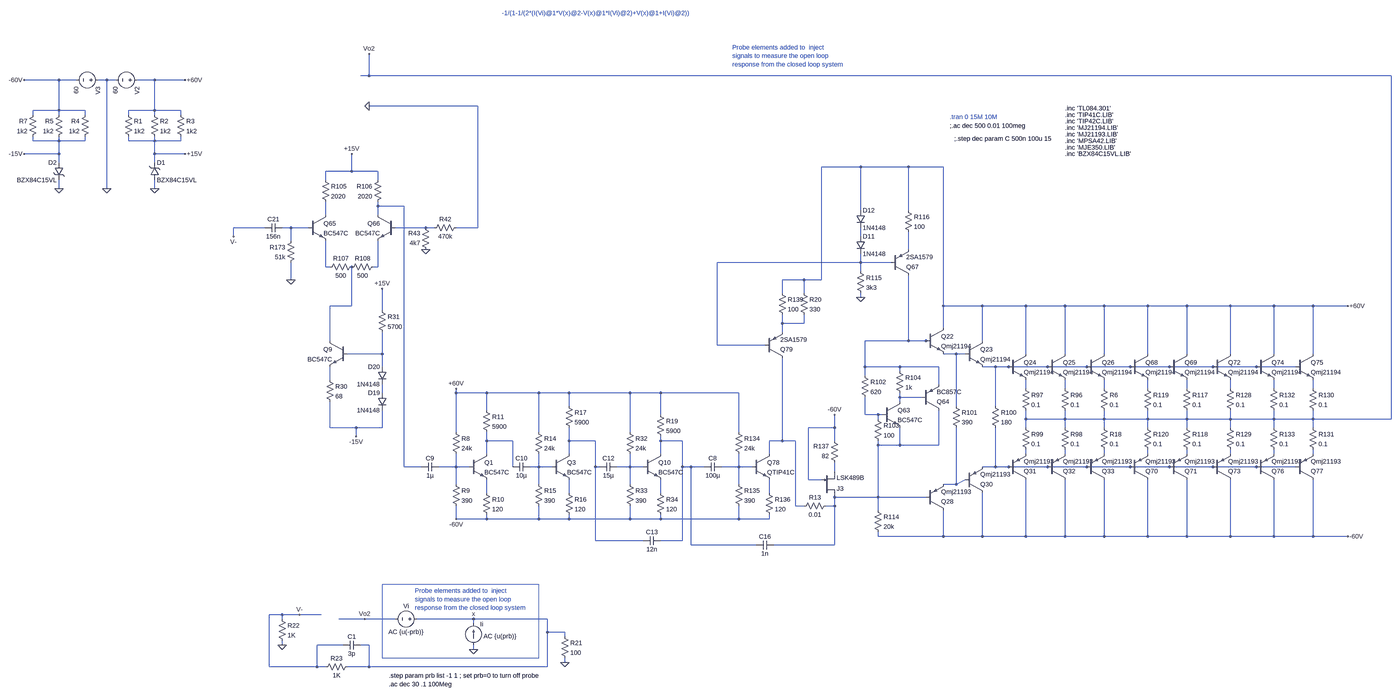
[diagram p0: schematic testV11_OL.asc, whole sheet]
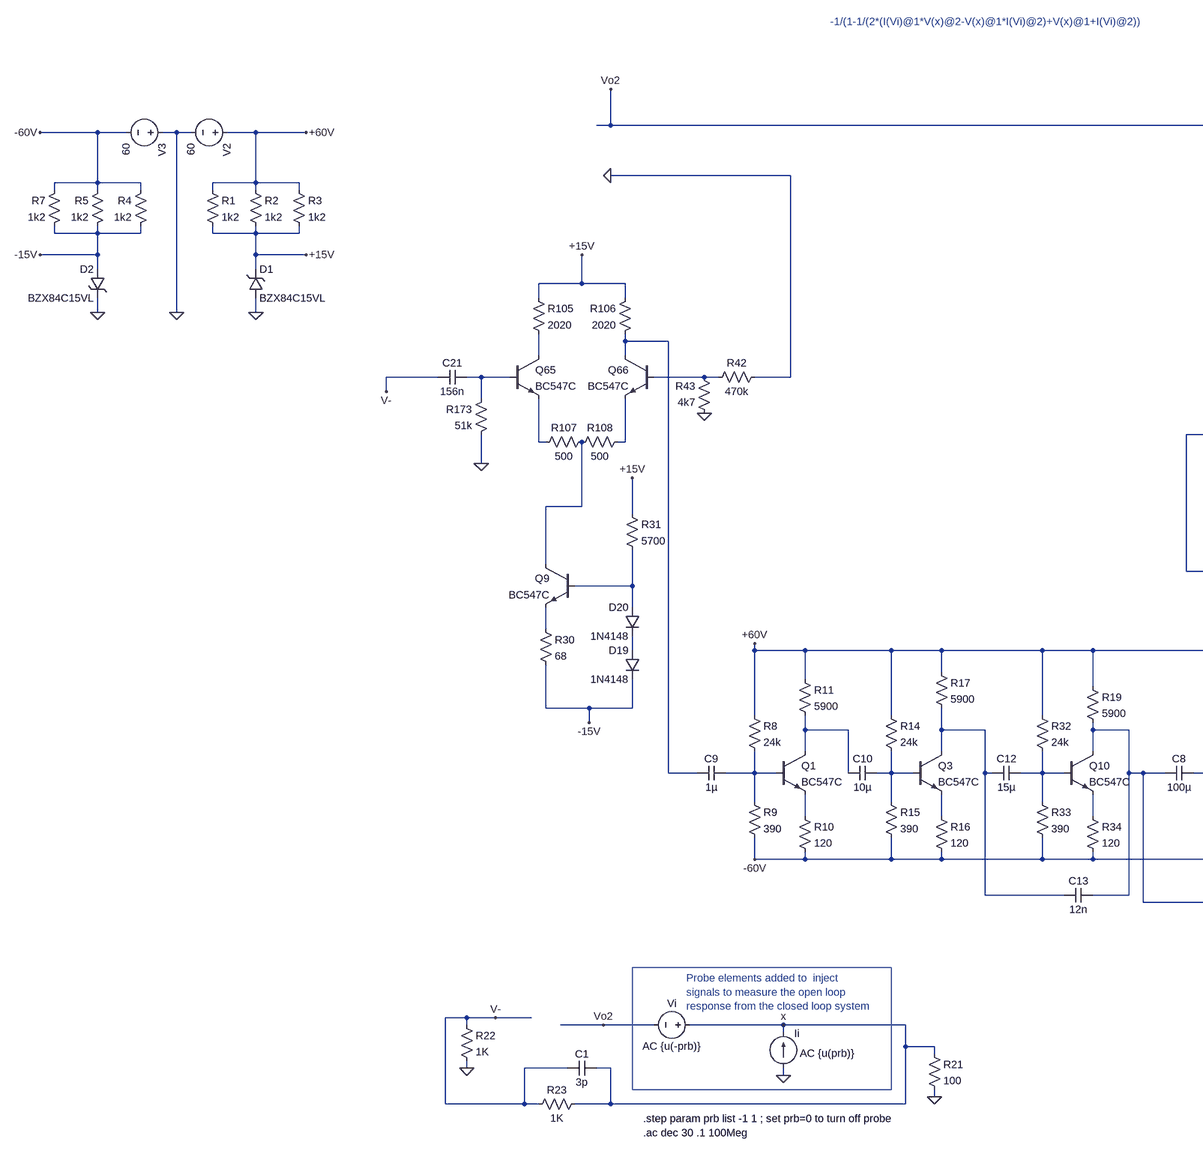
[diagram p1: schematic testV11_OL.asc, part, row 1 of 1, column 1 of 2]
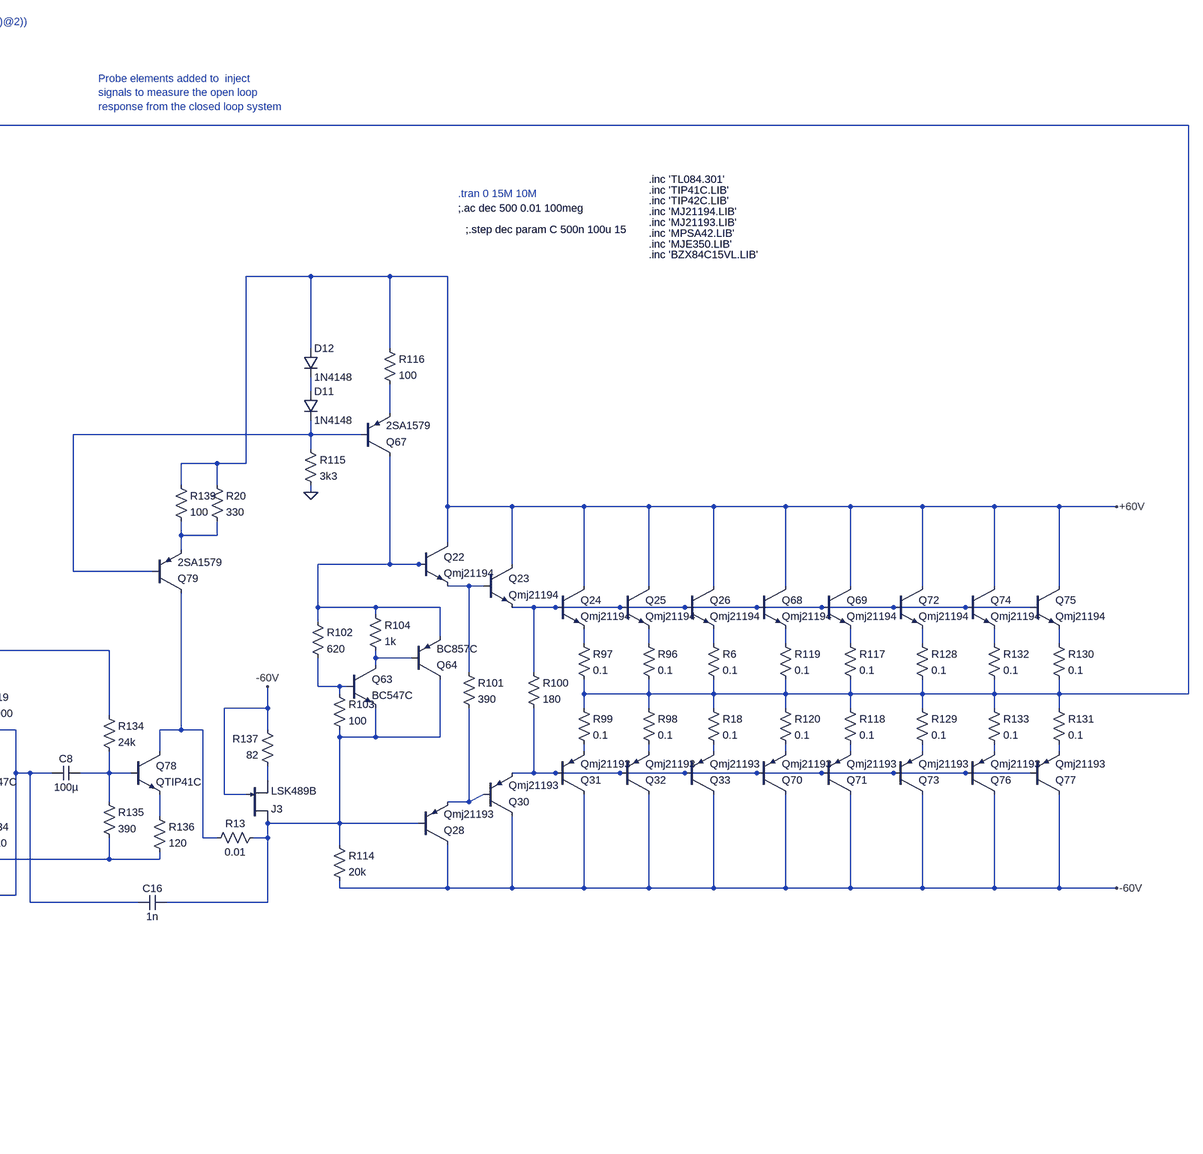
[diagram p2: schematic testV11_OL.asc, part, row 1 of 1, column 2 of 2]
testV11_OL.asc, the LTspice schematic file:
Version 4
SHEET 1 16980 7664
WIRE 7776 4208 7776 4128
WIRE 7776 4208 7744 4208
WIRE 11536 4208 7776 4208
WIRE 6560 4224 6432 4224
WIRE 6624 4224 6560 4224
WIRE 6736 4224 6704 4224
WIRE 6768 4224 6736 4224
WIRE 6912 4224 6848 4224
WIRE 7024 4224 6912 4224
WIRE 8176 4320 7776 4320
WIRE 6560 4336 6560 4224
WIRE 6560 4336 6464 4336
WIRE 6656 4336 6560 4336
WIRE 6912 4336 6912 4224
WIRE 6912 4336 6816 4336
WIRE 7008 4336 6912 4336
WIRE 6464 4352 6464 4336
WIRE 6560 4352 6560 4336
WIRE 6656 4352 6656 4336
WIRE 6816 4352 6816 4336
WIRE 6912 4352 6912 4336
WIRE 7008 4352 7008 4336
WIRE 6464 4448 6464 4432
WIRE 6560 4448 6560 4432
WIRE 6560 4448 6464 4448
WIRE 6656 4448 6656 4432
WIRE 6656 4448 6560 4448
WIRE 6816 4448 6816 4432
WIRE 6912 4448 6912 4432
WIRE 6912 4448 6816 4448
WIRE 7008 4448 7008 4432
WIRE 7008 4448 6912 4448
WIRE 6560 4496 6560 4448
WIRE 6560 4496 6432 4496
WIRE 6912 4496 6912 4448
WIRE 7024 4496 6912 4496
WIRE 6560 4528 6560 4496
WIRE 6912 4528 6912 4496
WIRE 9584 4544 9440 4544
WIRE 9760 4544 9584 4544
WIRE 9888 4544 9760 4544
WIRE 7712 4560 7712 4496
WIRE 7712 4560 7616 4560
WIRE 7808 4560 7712 4560
WIRE 7616 4592 7616 4560
WIRE 7808 4592 7808 4560
WIRE 6560 4624 6560 4592
WIRE 6736 4624 6736 4224
WIRE 6912 4624 6912 4592
WIRE 7808 4688 7808 4672
WIRE 7904 4688 7808 4688
WIRE 9584 4704 9584 4544
WIRE 9760 4704 9760 4544
WIRE 7616 4720 7616 4672
WIRE 7808 4720 7808 4688
WIRE 7392 4768 7232 4768
WIRE 7488 4768 7456 4768
WIRE 7552 4768 7488 4768
WIRE 7984 4768 7872 4768
WIRE 8016 4768 7984 4768
WIRE 8176 4768 8176 4320
WIRE 8176 4768 8096 4768
WIRE 7232 4800 7232 4768
WIRE 9584 4800 9584 4768
WIRE 7488 4816 7488 4768
WIRE 9760 4848 9760 4784
WIRE 9584 4896 9584 4864
WIRE 9584 4896 9056 4896
WIRE 9696 4896 9584 4896
WIRE 7616 4912 7616 4816
WIRE 7632 4912 7616 4912
WIRE 7808 4912 7808 4816
WIRE 7808 4912 7792 4912
WIRE 9584 4928 9584 4896
WIRE 7488 4960 7488 4896
WIRE 9376 4960 9296 4960
WIRE 9440 4960 9440 4544
WIRE 9440 4960 9376 4960
WIRE 9296 5008 9296 4960
WIRE 9376 5008 9376 4960
WIRE 9584 5024 9584 5008
WIRE 7712 5056 7712 4912
WIRE 7712 5056 7632 5056
WIRE 9888 5056 9888 4544
WIRE 10032 5056 9888 5056
WIRE 10192 5056 10032 5056
WIRE 10336 5056 10192 5056
WIRE 10480 5056 10336 5056
WIRE 10640 5056 10480 5056
WIRE 10784 5056 10640 5056
WIRE 10944 5056 10784 5056
WIRE 11104 5056 10944 5056
WIRE 11248 5056 11104 5056
WIRE 11376 5056 11248 5056
WIRE 7824 5072 7824 4992
WIRE 9296 5120 9296 5088
WIRE 9376 5120 9376 5088
WIRE 9376 5120 9296 5120
WIRE 9888 5136 9888 5056
WIRE 9296 5152 9296 5120
WIRE 7632 5184 7632 5056
WIRE 9760 5184 9760 4944
WIRE 9760 5184 9600 5184
WIRE 9824 5184 9760 5184
WIRE 9840 5184 9824 5184
WIRE 10032 5184 10032 5056
WIRE 9056 5200 9056 4896
WIRE 9232 5200 9056 5200
WIRE 7824 5232 7824 5152
WIRE 7824 5232 7696 5232
WIRE 9936 5232 9888 5232
WIRE 9968 5232 9936 5232
WIRE 10192 5232 10192 5056
WIRE 10336 5232 10336 5056
WIRE 10480 5232 10480 5056
WIRE 10640 5232 10640 5056
WIRE 10784 5232 10784 5056
WIRE 10944 5232 10944 5056
WIRE 11104 5232 11104 5056
WIRE 11248 5232 11248 5056
WIRE 7824 5280 7824 5232
WIRE 9600 5280 9600 5184
WIRE 9728 5280 9600 5280
WIRE 9872 5280 9728 5280
WIRE 10080 5280 10032 5280
WIRE 10128 5280 10080 5280
WIRE 10272 5280 10128 5280
WIRE 10416 5280 10272 5280
WIRE 10576 5280 10416 5280
WIRE 10720 5280 10576 5280
WIRE 10880 5280 10720 5280
WIRE 11040 5280 10880 5280
WIRE 11184 5280 11040 5280
WIRE 9728 5296 9728 5280
WIRE 9600 5312 9600 5280
WIRE 7632 5328 7632 5280
WIRE 9872 5344 9872 5280
WIRE 10192 5360 10192 5328
WIRE 10336 5360 10336 5328
WIRE 10480 5360 10480 5328
WIRE 10640 5360 10640 5328
WIRE 10784 5360 10784 5328
WIRE 10944 5360 10944 5328
WIRE 11104 5360 11104 5328
WIRE 11248 5360 11248 5328
WIRE 7824 5376 7824 5344
WIRE 8096 5376 8096 5360
WIRE 8208 5376 8096 5376
WIRE 8400 5376 8208 5376
WIRE 8512 5376 8400 5376
WIRE 8736 5376 8512 5376
WIRE 8848 5376 8736 5376
WIRE 9136 5376 8848 5376
WIRE 9728 5392 9728 5376
WIRE 9808 5392 9728 5392
WIRE 9728 5408 9728 5392
WIRE 8512 5424 8512 5376
WIRE 9936 5424 9936 5232
WIRE 10080 5424 10080 5280
WIRE 8208 5440 8208 5376
WIRE 8848 5456 8848 5376
WIRE 9600 5456 9600 5392
WIRE 9648 5456 9600 5456
WIRE 9664 5456 9648 5456
WIRE 9648 5472 9648 5456
WIRE 10192 5472 10192 5440
WIRE 10336 5472 10336 5440
WIRE 10336 5472 10192 5472
WIRE 10480 5472 10480 5440
WIRE 10480 5472 10336 5472
WIRE 10640 5472 10640 5440
WIRE 10640 5472 10480 5472
WIRE 10784 5472 10784 5440
WIRE 10784 5472 10640 5472
WIRE 10944 5472 10944 5440
WIRE 10944 5472 10784 5472
WIRE 11104 5472 11104 5440
WIRE 11104 5472 10944 5472
WIRE 11248 5472 11248 5440
WIRE 11248 5472 11104 5472
WIRE 11536 5472 11536 4208
WIRE 11536 5472 11248 5472
WIRE 7632 5504 7632 5408
WIRE 7728 5504 7632 5504
WIRE 7824 5504 7824 5440
WIRE 7824 5504 7728 5504
WIRE 9488 5504 9488 5456
WIRE 9488 5504 9392 5504
WIRE 10192 5504 10192 5472
WIRE 10336 5504 10336 5472
WIRE 10480 5504 10480 5472
WIRE 10640 5504 10640 5472
WIRE 10784 5504 10784 5472
WIRE 10944 5504 10944 5472
WIRE 11104 5504 11104 5472
WIRE 11248 5504 11248 5472
WIRE 8096 5520 8096 5376
WIRE 8400 5520 8400 5376
WIRE 8736 5520 8736 5376
WIRE 9136 5520 9136 5376
WIRE 7728 5536 7728 5504
WIRE 8208 5552 8208 5520
WIRE 8304 5552 8208 5552
WIRE 8512 5552 8512 5504
WIRE 8608 5552 8512 5552
WIRE 8848 5552 8848 5536
WIRE 8928 5552 8848 5552
WIRE 9296 5552 9296 5248
WIRE 9296 5552 9248 5552
WIRE 9344 5552 9296 5552
WIRE 9488 5552 9488 5504
WIRE 9648 5568 9648 5552
WIRE 9728 5568 9728 5504
WIRE 9728 5568 9648 5568
WIRE 9872 5568 9872 5440
WIRE 9872 5568 9728 5568
WIRE 8208 5600 8208 5552
WIRE 8512 5600 8512 5552
WIRE 8848 5600 8848 5552
WIRE 9248 5600 9248 5552
WIRE 10192 5600 10192 5584
WIRE 10336 5600 10336 5584
WIRE 10480 5600 10480 5584
WIRE 10640 5600 10640 5584
WIRE 10784 5600 10784 5584
WIRE 10944 5600 10944 5584
WIRE 11104 5600 11104 5584
WIRE 11248 5600 11248 5584
WIRE 7904 5648 7904 4688
WIRE 7968 5648 7904 5648
WIRE 8096 5648 8096 5600
WIRE 8096 5648 8032 5648
WIRE 8144 5648 8096 5648
WIRE 8304 5648 8304 5552
WIRE 8400 5648 8400 5600
WIRE 8400 5648 8368 5648
WIRE 8448 5648 8400 5648
WIRE 8608 5648 8608 5552
WIRE 8624 5648 8608 5648
WIRE 8736 5648 8736 5600
WIRE 8736 5648 8688 5648
WIRE 8784 5648 8736 5648
WIRE 8928 5648 8928 5552
WIRE 8960 5648 8928 5648
WIRE 9008 5648 8960 5648
WIRE 9136 5648 9136 5600
WIRE 9136 5648 9072 5648
WIRE 9184 5648 9136 5648
WIRE 10080 5648 10080 5504
WIRE 10080 5648 10032 5648
WIRE 10128 5648 10080 5648
WIRE 10272 5648 10128 5648
WIRE 10416 5648 10272 5648
WIRE 10576 5648 10416 5648
WIRE 10720 5648 10576 5648
WIRE 10880 5648 10720 5648
WIRE 11040 5648 10880 5648
WIRE 11184 5648 11040 5648
WIRE 9488 5664 9488 5632
WIRE 9392 5696 9392 5504
WIRE 9440 5696 9392 5696
WIRE 8096 5712 8096 5648
WIRE 8400 5712 8400 5648
WIRE 8736 5712 8736 5648
WIRE 9136 5712 9136 5648
WIRE 9936 5712 9936 5504
WIRE 9936 5712 9968 5696
WIRE 9936 5712 9888 5712
WIRE 8208 5744 8208 5696
WIRE 8512 5744 8512 5696
WIRE 8848 5744 8848 5696
WIRE 9248 5744 9248 5696
WIRE 9648 5760 9648 5568
WIRE 9648 5760 9488 5760
WIRE 9824 5760 9648 5760
WIRE 9344 5792 9344 5552
WIRE 9376 5792 9344 5792
WIRE 9488 5792 9488 5760
WIRE 9488 5792 9456 5792
WIRE 9648 5808 9648 5760
WIRE 8096 5840 8096 5792
WIRE 8208 5840 8208 5824
WIRE 8208 5840 8096 5840
WIRE 8400 5840 8400 5792
WIRE 8400 5840 8208 5840
WIRE 8512 5840 8512 5824
WIRE 8512 5840 8400 5840
WIRE 8736 5840 8736 5792
WIRE 8736 5840 8512 5840
WIRE 8848 5840 8848 5824
WIRE 8848 5840 8736 5840
WIRE 9136 5840 9136 5792
WIRE 9136 5840 8848 5840
WIRE 9248 5840 9248 5824
WIRE 9248 5840 9136 5840
WIRE 9648 5904 9648 5888
WIRE 9888 5904 9888 5808
WIRE 9888 5904 9648 5904
WIRE 10032 5904 10032 5744
WIRE 10032 5904 9888 5904
WIRE 10192 5904 10192 5696
WIRE 10192 5904 10032 5904
WIRE 10336 5904 10336 5696
WIRE 10336 5904 10192 5904
WIRE 10480 5904 10480 5696
WIRE 10480 5904 10336 5904
WIRE 10640 5904 10640 5696
WIRE 10640 5904 10480 5904
WIRE 10784 5904 10784 5696
WIRE 10784 5904 10640 5904
WIRE 10944 5904 10944 5696
WIRE 10944 5904 10784 5904
WIRE 11104 5904 11104 5696
WIRE 11104 5904 10944 5904
WIRE 11248 5904 11248 5696
WIRE 11248 5904 11104 5904
WIRE 11376 5904 11248 5904
WIRE 8608 5920 8608 5648
WIRE 8784 5920 8608 5920
WIRE 8928 5920 8928 5648
WIRE 8928 5920 8848 5920
WIRE 8960 5936 8960 5648
WIRE 9200 5936 8960 5936
WIRE 9488 5936 9488 5792
WIRE 9488 5936 9264 5936
WIRE 7456 6544 7408 6544
WIRE 7520 6544 7456 6544
WIRE 7600 6544 7520 6544
WIRE 7456 6560 7456 6544
WIRE 7760 6560 7664 6560
WIRE 7872 6560 7760 6560
WIRE 8160 6560 7952 6560
WIRE 8432 6560 8160 6560
WIRE 8160 6576 8160 6560
WIRE 8432 6608 8432 6560
WIRE 8496 6608 8432 6608
WIRE 8496 6624 8496 6608
WIRE 7456 6656 7456 6640
WIRE 7680 6656 7584 6656
WIRE 7776 6656 7744 6656
WIRE 8160 6672 8160 6656
WIRE 8496 6720 8496 6704
WIRE 7408 6736 7408 6544
WIRE 7584 6736 7584 6656
WIRE 7584 6736 7408 6736
WIRE 7616 6736 7584 6736
WIRE 7776 6736 7776 6656
WIRE 7776 6736 7696 6736
WIRE 8432 6736 8432 6608
WIRE 8432 6736 7776 6736
FLAG 6736 4624 0
FLAG 7024 4224 +60V
FLAG 6432 4224 -60V
FLAG 7712 4496 +15V
FLAG 9584 5024 0
FLAG 11376 5904 -60V
FLAG 11376 5056 +60V
FLAG 7488 4960 0
FLAG 9488 5456 -60V
FLAG 6912 4624 0
FLAG 6560 4624 0
FLAG 7024 4496 +15V
FLAG 6432 4496 -15V
FLAG 7776 4128 Vo2
FLAG 7728 5536 -15V
FLAG 7824 4992 +15V
FLAG 8096 5360 +60V
FLAG 8096 5840 -60V
FLAG 7984 4848 0
FLAG 7456 6656 0
FLAG 8496 6720 0
FLAG 8160 6672 0
FLAG 8160 6560 x
FLAG 7520 6544 V-
FLAG 7760 6560 Vo2
FLAG 7232 4800 V-
FLAG 7776 4320 0
SYMBOL voltage 6864 4224 R90
WINDOW 123 0 0 Left 0
WINDOW 39 24 44 Left 2
SYMATTR InstName V2
SYMATTR Value 60
SYMBOL voltage 6720 4224 R90
WINDOW 123 0 0 Left 0
WINDOW 39 24 124 Left 2
SYMATTR InstName V3
SYMATTR Value 60
SYMBOL npn 9824 5136 R0
SYMATTR InstName Q22
SYMATTR Value Qmj21194
SYMBOL npn 9968 5184 R0
SYMATTR InstName Q23
SYMATTR Value Qmj21194
SYMBOL npn 10128 5232 R0
SYMATTR InstName Q24
SYMATTR Value Qmj21194
SYMBOL npn 10272 5232 R0
SYMATTR InstName Q25
SYMATTR Value Qmj21194
SYMBOL npn 10416 5232 R0
SYMATTR InstName Q26
SYMATTR Value Qmj21194
SYMBOL pnp 9824 5808 M180
SYMATTR InstName Q28
SYMATTR Value Qmj21193
SYMBOL pnp 9968 5744 M180
SYMATTR InstName Q30
SYMATTR Value Qmj21193
SYMBOL pnp 10128 5696 M180
SYMATTR InstName Q31
SYMATTR Value Qmj21193
SYMBOL pnp 10272 5696 M180
SYMATTR InstName Q32
SYMATTR Value Qmj21193
SYMBOL pnp 10416 5696 M180
SYMATTR InstName Q33
SYMATTR Value Qmj21193
SYMBOL res 10464 5344 R0
SYMATTR InstName R6
SYMATTR Value 0.1
SYMBOL res 10464 5488 R0
SYMATTR InstName R18
SYMATTR Value 0.1
SYMBOL res 10320 5344 R0
SYMATTR InstName R96
SYMATTR Value 0.1
SYMBOL res 10176 5344 R0
SYMATTR InstName R97
SYMATTR Value 0.1
SYMBOL res 10320 5488 R0
SYMATTR InstName R98
SYMATTR Value 0.1
SYMBOL res 10176 5488 R0
SYMATTR InstName R99
SYMATTR Value 0.1
SYMBOL res 10064 5408 R0
SYMATTR InstName R100
SYMATTR Value 180
SYMBOL res 9920 5408 R0
SYMATTR InstName R101
SYMATTR Value 390
SYMBOL npn 9664 5408 R0
SYMATTR InstName Q63
SYMATTR Value BC547C
SYMBOL res 9584 5296 R0
SYMATTR InstName R102
SYMATTR Value 620
SYMBOL res 9632 5456 R0
SYMATTR InstName R103
SYMATTR Value 100
SYMBOL res 9712 5280 R0
SYMATTR InstName R104
SYMATTR Value 1k
SYMBOL pnp 9808 5440 M180
SYMATTR InstName Q64
SYMATTR Value BC857C
SYMBOL npn 7552 4720 R0
SYMATTR InstName Q65
SYMATTR Value BC547C
SYMBOL npn 7872 4720 M0
SYMATTR InstName Q66
SYMATTR Value BC547C
SYMBOL res 7600 4576 R0
SYMATTR InstName R105
SYMATTR Value 2020
SYMBOL res 7824 4576 M0
SYMATTR InstName R106
SYMATTR Value 2020
SYMBOL res 7728 4896 R90
WINDOW 0 0 56 VBottom 2
WINDOW 3 32 56 VTop 2
SYMATTR InstName R107
SYMATTR Value 500
SYMBOL res 7808 4896 R90
WINDOW 0 0 56 VBottom 2
WINDOW 3 32 56 VTop 2
SYMATTR InstName R108
SYMATTR Value 500
SYMBOL res 9632 5792 R0
SYMATTR InstName R114
SYMATTR Value 20k
SYMBOL pnp 9696 4944 M180
SYMATTR InstName Q67
SYMATTR Value 2SA1579
SYMBOL res 9568 4912 R0
SYMATTR InstName R115
SYMATTR Value 3k3
SYMBOL diode 9568 4800 R0
SYMATTR InstName D11
SYMATTR Value 1N4148
SYMBOL diode 9568 4704 R0
SYMATTR InstName D12
SYMATTR Value 1N4148
SYMBOL res 9744 4688 R0
SYMATTR InstName R116
SYMATTR Value 100
SYMBOL npn 10576 5232 R0
SYMATTR InstName Q68
SYMATTR Value Qmj21194
SYMBOL npn 10720 5232 R0
SYMATTR InstName Q69
SYMATTR Value Qmj21194
SYMBOL pnp 10576 5696 M180
SYMATTR InstName Q70
SYMATTR Value Qmj21193
SYMBOL pnp 10720 5696 M180
SYMATTR InstName Q71
SYMATTR Value Qmj21193
SYMBOL res 10768 5344 R0
SYMATTR InstName R117
SYMATTR Value 0.1
SYMBOL res 10768 5488 R0
SYMATTR InstName R118
SYMATTR Value 0.1
SYMBOL res 10624 5344 R0
SYMATTR InstName R119
SYMATTR Value 0.1
SYMBOL res 10624 5488 R0
SYMATTR InstName R120
SYMATTR Value 0.1
SYMBOL npn 10880 5232 R0
SYMATTR InstName Q72
SYMATTR Value Qmj21194
SYMBOL pnp 10880 5696 M180
SYMATTR InstName Q73
SYMATTR Value Qmj21193
SYMBOL res 10928 5344 R0
SYMATTR InstName R128
SYMATTR Value 0.1
SYMBOL res 10928 5488 R0
SYMATTR InstName R129
SYMATTR Value 0.1
SYMBOL npn 11040 5232 R0
SYMATTR InstName Q74
SYMATTR Value Qmj21194
SYMBOL npn 11184 5232 R0
SYMATTR InstName Q75
SYMATTR Value Qmj21194
SYMBOL pnp 11040 5696 M180
SYMATTR InstName Q76
SYMATTR Value Qmj21193
SYMBOL pnp 11184 5696 M180
SYMATTR InstName Q77
SYMATTR Value Qmj21193
SYMBOL res 11232 5344 R0
SYMATTR InstName R130
SYMATTR Value 0.1
SYMBOL res 11232 5488 R0
SYMATTR InstName R131
SYMATTR Value 0.1
SYMBOL res 11088 5344 R0
SYMATTR InstName R132
SYMATTR Value 0.1
SYMBOL res 11088 5488 R0
SYMATTR InstName R133
SYMATTR Value 0.1
SYMBOL res 9120 5504 R0
SYMATTR InstName R134
SYMATTR Value 24k
SYMBOL res 9120 5696 R0
SYMATTR InstName R135
SYMATTR Value 390
SYMBOL npn 9184 5600 R0
SYMATTR InstName Q78
SYMATTR Value QTIP41C
SYMBOL res 9232 5728 R0
SYMATTR InstName R136
SYMATTR Value 120
SYMBOL njf 9440 5760 M180
SYMATTR InstName J3
SYMATTR Value LSK489B
SYMBOL res 9504 5648 R180
WINDOW 0 36 76 Left 2
WINDOW 3 36 40 Left 2
SYMATTR InstName R137
SYMATTR Value 82
SYMBOL pnp 9232 5248 M180
SYMATTR InstName Q79
SYMATTR Value 2SA1579
SYMBOL res 9280 4992 R0
SYMATTR InstName R139
SYMATTR Value 100
SYMBOL cap 9264 5920 R90
WINDOW 0 0 32 VBottom 2
WINDOW 3 32 32 VTop 2
SYMATTR InstName C16
SYMATTR Value 1n
SYMATTR SpiceLine Rser=0.1
SYMBOL cap 7456 4752 R90
WINDOW 0 0 32 VBottom 2
WINDOW 3 32 32 VTop 2
SYMATTR InstName C21
SYMATTR Value 156n
SYMATTR SpiceLine Rser=0.1
SYMBOL res 7504 4800 M0
SYMATTR InstName R173
SYMATTR Value 51k
SYMBOL res 6800 4336 R0
SYMATTR InstName R1
SYMATTR Value 1k2
SYMBOL res 6896 4336 R0
SYMATTR InstName R2
SYMATTR Value 1k2
SYMBOL res 6992 4336 R0
SYMATTR InstName R3
SYMATTR Value 1k2
SYMBOL res 6672 4336 M0
SYMATTR InstName R4
SYMATTR Value 1k2
SYMBOL res 6576 4336 M0
SYMATTR InstName R5
SYMATTR Value 1k2
SYMBOL res 6480 4336 M0
SYMATTR InstName R7
SYMATTR Value 1k2
SYMBOL zener 6896 4592 M180
WINDOW 0 24 64 Left 2
WINDOW 3 24 0 Left 2
SYMATTR InstName D1
SYMATTR Value BZX84C15VL
SYMBOL zener 6576 4528 M0
SYMATTR InstName D2
SYMATTR Value BZX84C15VL
SYMBOL res 9472 5776 R90
WINDOW 0 0 56 VBottom 2
WINDOW 3 32 56 VTop 2
SYMATTR InstName R13
SYMATTR Value 0.01
SYMBOL diode 7840 5376 M0
SYMATTR InstName D19
SYMATTR Value 1N4148
SYMBOL diode 7840 5280 M0
SYMATTR InstName D20
SYMATTR Value 1N4148
SYMBOL npn 7696 5184 M0
SYMATTR InstName Q9
SYMATTR Value BC547C
SYMBOL res 7616 5312 R0
SYMATTR InstName R30
SYMATTR Value 68
SYMBOL res 7808 5056 R0
SYMATTR InstName R31
SYMATTR Value 5700
SYMBOL res 8080 5504 R0
SYMATTR InstName R8
SYMATTR Value 24k
SYMBOL res 8080 5696 R0
SYMATTR InstName R9
SYMATTR Value 390
SYMBOL npn 8144 5600 R0
SYMATTR InstName Q1
SYMATTR Value BC547C
SYMBOL res 8192 5728 R0
SYMATTR InstName R10
SYMATTR Value 120
SYMBOL res 8384 5504 R0
SYMATTR InstName R14
SYMATTR Value 24k
SYMBOL res 8384 5696 R0
SYMATTR InstName R15
SYMATTR Value 390
SYMBOL npn 8448 5600 R0
SYMATTR InstName Q3
SYMATTR Value BC547C
SYMBOL res 8496 5728 R0
SYMATTR InstName R16
SYMATTR Value 120
SYMBOL res 8720 5504 R0
SYMATTR InstName R32
SYMATTR Value 24k
SYMBOL res 8720 5696 R0
SYMATTR InstName R33
SYMATTR Value 390
SYMBOL npn 8784 5600 R0
SYMATTR InstName Q10
SYMATTR Value BC547C
SYMBOL res 8832 5728 R0
SYMATTR InstName R34
SYMATTR Value 120
SYMBOL res 8112 4752 R90
WINDOW 0 0 56 VBottom 2
WINDOW 3 32 56 VTop 2
SYMATTR InstName R42
SYMATTR Value 470k
SYMBOL res 8000 4864 R180
WINDOW 0 36 76 Left 2
WINDOW 3 36 40 Left 2
SYMATTR InstName R43
SYMATTR Value 4k7
SYMBOL res 8192 5424 R0
SYMATTR InstName R11
SYMATTR Value 5900
SYMBOL res 8496 5408 R0
SYMATTR InstName R17
SYMATTR Value 5900
SYMBOL res 8832 5440 R0
SYMATTR InstName R19
SYMATTR Value 5900
SYMBOL cap 8784 5904 M90
WINDOW 0 0 32 VBottom 2
WINDOW 3 32 32 VTop 2
SYMATTR InstName C13
SYMATTR Value 12n
SYMATTR SpiceLine Rser=0.1
SYMBOL cap 9008 5632 M90
WINDOW 0 0 32 VBottom 2
WINDOW 3 32 32 VTop 2
SYMATTR InstName C8
SYMATTR Value 100µ
SYMATTR SpiceLine Rser=0.1
SYMBOL cap 8032 5632 R90
WINDOW 0 0 32 VBottom 2
WINDOW 3 32 32 VTop 2
SYMATTR InstName C9
SYMATTR Value 1µ
SYMBOL cap 8368 5632 R90
WINDOW 0 0 32 VBottom 2
WINDOW 3 32 32 VTop 2
SYMATTR InstName C10
SYMATTR Value 10µ
SYMBOL cap 8688 5632 R90
WINDOW 0 0 32 VBottom 2
WINDOW 3 32 32 VTop 2
SYMATTR InstName C12
SYMATTR Value 15µ
SYMBOL res 9360 4992 R0
SYMATTR InstName R20
SYMATTR Value 330
SYMBOL res 8480 6608 R0
SYMATTR InstName R21
SYMATTR Value 100
SYMBOL res 7440 6544 R0
SYMATTR InstName R22
SYMATTR Value 1K
SYMBOL res 7712 6720 R90
WINDOW 0 0 56 VBottom 2
WINDOW 3 32 56 VTop 2
SYMATTR InstName R23
SYMATTR Value 1K
SYMBOL cap 7744 6640 R90
WINDOW 0 0 32 VBottom 2
WINDOW 3 32 32 VTop 2
SYMATTR InstName C1
SYMATTR Value 3p
SYMBOL current 8160 6656 M180
WINDOW 0 24 77 Left 2
WINDOW 3 24 0 Left 2
WINDOW 123 37 33 Left 2
WINDOW 39 0 0 Left 2
SYMATTR InstName Ii
SYMATTR Value ""
SYMATTR Value2 AC {u(prb)}
SYMBOL voltage 7968 6560 M270
WINDOW 0 32 56 VTop 2
WINDOW 3 -32 56 VBottom 2
WINDOW 123 -32 56 VBottom 2
WINDOW 39 -32 56 VBottom 2
SYMATTR InstName Vi
SYMATTR Value ""
SYMATTR Value2 AC {u(-prb)}
TEXT 10336 4328 Left 2 !.inc 'TL084.301'
TEXT 10336 4352 Left 2 !.inc 'TIP41C.LIB'
TEXT 10336 4376 Left 2 !.inc 'TIP42C.LIB'
TEXT 10336 4400 Left 2 !.inc 'MJ21194.LIB'
TEXT 10336 4424 Left 2 !.inc 'MJ21193.LIB'
TEXT 10336 4448 Left 2 !.inc 'MPSA42.LIB'
TEXT 10336 4472 Left 2 !.inc 'MJE350.LIB'
TEXT 10336 4496 Left 2 !.inc 'BZX84C15VL.LIB'
TEXT 9912 4360 Left 2 ;.tran 0 15M 10M
TEXT 9912 4392 Left 2 !;.ac dec 500 0.01 100meg
TEXT 9928 4440 Left 2 !;.step dec param C 500n 100u 15
TEXT 9112 4104 Left 2 ;Probe elements added to  inject\nsignals to measure the open loop\nresponse from the closed loop system
TEXT 8264 3912 Left 2 ;-1/(1-1/(2*(I(Vi)@1*V(x)@2-V(x)@1*I(Vi)@2)+V(x)@1+I(Vi)@2))
TEXT 7848 6800 Left 2 !.ac dec 30 .1 100Meg
TEXT 7848 6768 Left 2 !.step param prb list -1 1 ; set prb=0 to turn off probe
TEXT 7944 6456 Left 2 ;Probe elements added to  inject\nsignals to measure the open loop\nresponse from the closed loop system
RECTANGLE Normal 8400 6704 7824 6432

The netlist it stands for:
* testV11_OL.asc
V2 +60V 0 60
V3 0 -60V 60
Q22 +60V N012 N014 0 Qmj21194
Q23 +60V N014 N015 0 Qmj21194
Q24 +60V N015 N017 0 Qmj21194
Q25 +60V N015 N018 0 Qmj21194
Q26 +60V N015 N019 0 Qmj21194
Q28 -60V N032 N047 0 Qmj21193
Q30 -60V N047 N045 0 Qmj21193
Q31 -60V N045 N033 0 Qmj21193
Q32 -60V N045 N034 0 Qmj21193
Q33 -60V N045 N035 0 Qmj21193
R6 N019 Vo2 0.1
R18 Vo2 N035 0.1
R96 N018 Vo2 0.1
R97 N017 Vo2 0.1
R98 Vo2 N034 0.1
R99 Vo2 N033 0.1
R100 N015 N045 180
R101 N014 N047 390
Q63 N026 N027 N032 0 BC547C
R102 N012 N027 620
R103 N027 N032 100
R104 N012 N026 1k
Q64 N032 N026 N012 0 BC857C
Q65 N002 N003 N008 0 BC547C
Q66 N001 N004 N009 0 BC547C
R105 +15V N002 2020
R106 +15V N001 2020
R107 N010 N008 500
R108 N009 N010 500
R114 N032 -60V 20k
Q67 N012 N007 N006 0 2SA1579
R115 N007 0 3k3
D11 N005 N007 1N4148
D12 +60V N005 1N4148
R116 +60V N006 100
Q68 +60V N015 N020 0 Qmj21194
Q69 +60V N015 N021 0 Qmj21194
Q70 -60V N045 N036 0 Qmj21193
Q71 -60V N045 N037 0 Qmj21193
R117 N021 Vo2 0.1
R118 Vo2 N037 0.1
R119 N020 Vo2 0.1
R120 Vo2 N036 0.1
Q72 +60V N015 N022 0 Qmj21194
Q73 -60V N045 N038 0 Qmj21193
R128 N022 Vo2 0.1
R129 Vo2 N038 0.1
Q74 +60V N015 N023 0 Qmj21194
Q75 +60V N015 N024 0 Qmj21194
Q76 -60V N045 N039 0 Qmj21193
Q77 -60V N045 N040 0 Qmj21193
R130 N024 Vo2 0.1
R131 Vo2 N040 0.1
R132 N023 Vo2 0.1
R133 Vo2 N039 0.1
R134 +60V N044 24k
R135 N044 -60V 390
Q78 N031 N044 N051 0 QTIP41C
R136 N051 -60V 120
J3 N032 -60V N046 LSK489B
R137 N046 -60V 82
Q79 N031 N007 N011 0 2SA1579
R139 +60V N011 100
C16 N032 N030 1n Rser=0.1
C21 N003 V- 156n Rser=0.1
R173 N003 0 51k
R1 +60V +15V 1k2
R2 +60V +15V 1k2
R3 +60V +15V 1k2
R4 -60V -15V 1k2
R5 -60V -15V 1k2
R7 -60V -15V 1k2
D1 0 +15V BZX84C15VL
D2 -15V 0 BZX84C15VL
R13 N032 N031 0.01
D19 N025 -15V 1N4148
D20 N013 N025 1N4148
Q9 N010 N013 N016 0 BC547C
R30 N016 -15V 68
R31 +15V N013 5700
R8 +60V N041 24k
R9 N041 -60V 390
Q1 N028 N041 N048 0 BC547C
R10 N048 -60V 120
R14 +60V N042 24k
R15 N042 -60V 390
Q3 N029 N042 N049 0 BC547C
R16 N049 -60V 120
R32 +60V N043 24k
R33 N043 -60V 390
Q10 N030 N043 N050 0 BC547C
R34 N050 -60V 120
R42 0 N004 470k
R43 0 N004 4k7
R11 +60V N028 5900
R17 +60V N029 5900
R19 +60V N030 5900
C13 N029 N030 12n Rser=0.1
C8 N030 N044 100µ Rser=0.1
C9 N041 N001 1µ
C10 N042 N028 10µ
C12 N043 N029 15µ
R20 +60V N011 330
R21 x 0 100
R22 V- 0 1K
R23 x V- 1K
C1 x V- 3p
Ii 0 x AC {u(prb)}
Vi x Vo2 AC {u(-prb)}
.model D D
.lib standard.dio
.model NPN NPN
.model PNP PNP
.lib standard.bjt
.model NJF NJF
.model PJF PJF
.lib standard.jft
.inc 'TL084.301'
.inc 'TIP41C.LIB'
.inc 'TIP42C.LIB'
.inc 'MJ21194.LIB'
.inc 'MJ21193.LIB'
.inc 'MPSA42.LIB'
.inc 'MJE350.LIB'
.inc 'BZX84C15VL.LIB'
* .tran 0 15M 10M
;.ac dec 500 0.01 100meg
;.step dec param C 500n 100u 15
* Probe elements added to  inject
* signals to measure the open loop
* response from the closed loop system
* -1/(1-1/(2*(I(Vi)@1*V(x)@2-V(x)@1*I(Vi)@2)+V(x)@1+I(Vi)@2))
.ac dec 30 .1 100Meg
.step param prb list -1 1 ; set prb=0 to turn off probe
* Probe elements added to  inject
* signals to measure the open loop
* response from the closed loop system
.backanno
.end